# EAGLE design Qwiic_BME688 (EAGLE 9.5.2)
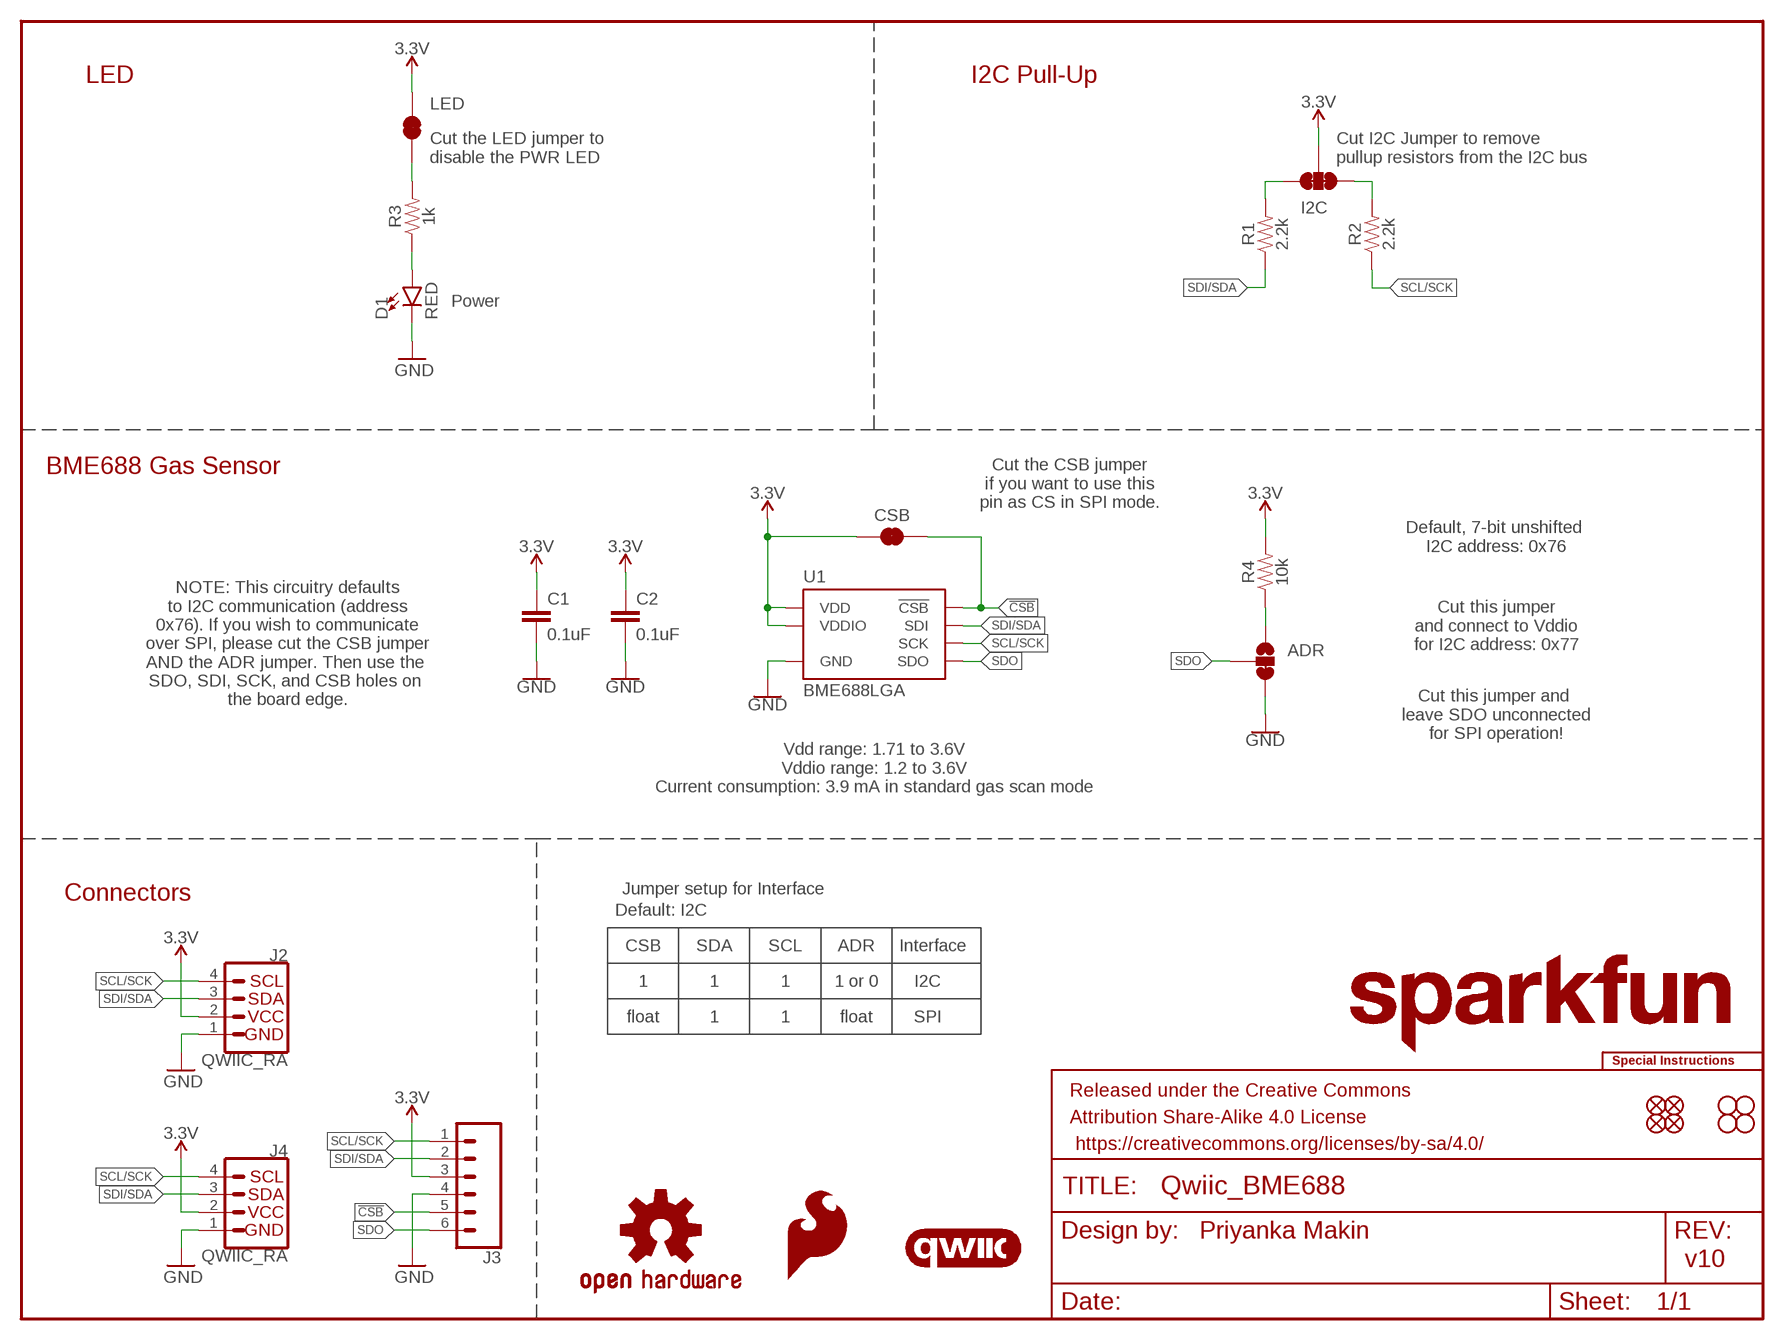
[diagram p0: schematic, sheet 1]

## Parts
ADR  JUMPER-SMT_3_1-NC_TRACE_SILK  [SMT-JUMPER_3_1-NC_TRACE_SILK]
C1  0.1uF  0.1UF-0603-100V-10%  [0603]
C2  0.1uF  0.1UF-0603-100V-10%  [0603]
CSB  JUMPER-SMT_2_NC_TRACE_SILK  [SMT-JUMPER_2_NC_TRACE_SILK]
D1  RED  LED-RED0603  [LED-0603]
FRAME1  FRAME-LETTER  [CREATIVE_COMMONS]
I2C  JUMPER-SMT_3_2-NC_TRACE_SILK  [SMT-JUMPER_3_2-NC_TRACE_SILK]
J2  QWIIC_RA  QWIIC_CONNECTORJS-1MM  [JST04_1MM_RA]
J3  CONN_06NO_SILK_NO_POP  [1X06_NO_SILK]
J4  QWIIC_RA  QWIIC_CONNECTORJS-1MM  [JST04_1MM_RA]
JP1  FIDUCIALUFIDUCIAL  [FIDUCIAL-MICRO]
JP2  FIDUCIALUFIDUCIAL  [FIDUCIAL-MICRO]
JP3  STAND-OFF  [STAND-OFF]
JP4  STAND-OFF  [STAND-OFF]
JP5  FIDUCIALUFIDUCIAL  [FIDUCIAL-MICRO]
JP6  FIDUCIALUFIDUCIAL  [FIDUCIAL-MICRO]
JP7  STAND-OFF  [STAND-OFF]
JP8  STAND-OFF  [STAND-OFF]
LED  JUMPER-SMT_2_NC_TRACE_SILK  [SMT-JUMPER_2_NC_TRACE_SILK]
LOGO1  SPECIAL_INSTRUCTIONS-ORDERING  [ORDERING_INSTRUCTIONS]
LOGO2  QWIIC_LOGO_5MM  [QWIIC_5MM]
LOGO3  SFE_LOGO_NAME.1_INCH  [SFE_LOGO_NAME_.1]
LOGO4  SFE_LOGO_FLAME.1_INCH  [SFE_LOGO_FLAME_.1]
LOGO5  OSHW-LOGOS  [OSHW-LOGO-S]
LOGO6  SFE_LOGO_NAME.1_INCH  [SFE_LOGO_NAME_.1]
R1  2.2k  2.2KOHM-0603-1/10W-1%  [0603]
R2  2.2k  2.2KOHM-0603-1/10W-1%  [0603]
R3  1k  1KOHM-0603-1/10W-1%  [0603]
R4  10k  10KOHM-0603-1/10W-1%  [0603]
U1  BME688LGA  [LGA_8PIN]

## Nets
3.3V: C1.1 C2.1 CSB.1 I2C.2 J2.2 J3.3 J4.2 LED.2 R4.2 U1.6(VDDIO) U1.8(VDD)
!CSB!: CSB.2 J3.5 U1.2(!CSB!)
GND: ADR.3 C1.2 C2.2 D1.C J2.1 J3.4 J4.1 U1.1(GND) U1.7(GND)
N$1: LED.1 R3.2
N$2: I2C.3 R1.2
N$3: D1.A R3.1
N$4: I2C.1 R2.2
N$5: ADR.1 R4.1
SCL/SCK: J2.4 J3.1 J4.4 R2.1 U1.4(SCK)
SDI/SDA: J2.3 J3.2 J4.3 R1.1 U1.3(SDI)
SDO: ADR.2 J3.6 U1.5(SDO)

## Notes on the sheet
- LED | I2C Pull-Up
- Cut the LED jumper to
  disable the PWR LED
- Cut I2C Jumper to remove 
  pullup resistors from the I2C bus
- Power
- BME688 Gas Sensor
- Cut the CSB jumper
  if you want to use this
  pin as CS in SPI mode.
- Default, 7-bit unshifted 
  I2C address: 0x76
- Cut this jumper
  and connect to Vddio
  for I2C address: 0x77
- NOTE: This circuitry defaults
  to I2C communication (address
  0x76). If you wish to communicate
  over SPI, please cut the CSB jumper
  AND the ADR jumper. Then use the 
  SDO, SDI, SCK, and CSB holes on 
  the board edge.
- Cut this jumper and 
  leave SDO unconnected
  for SPI operation!
- Vdd range: 1.71 to 3.6V
  Vddio range: 1.2 to 3.6V
  Current consumption: 3.9 mA in standard gas scan mode
- Connectors | Jumper setup for Interface
- Default: I2C
- CSB | SDA | SCL | ADR | Interface
- 1 | 1 | 1 | 1 or 0 | I2C
- float | 1 | 1 | float | SPI
- Priyanka Makin
- v10

## Library data of the parts
ADR = SparkFun-Jumpers:JUMPER-SMT_3_1-NC_TRACE: Normally closed trace jumper (1 of 2 connections) This jumper has a trace between two pads so it's normally closed (NC). The other connection is normally open (NO). Use a razor knife to open the connection. For best results follow the IPC guidelines for cutting traces: Cutout at least 0.063 mm (0.005 in). Remove all loose material to clean up the cut area. Seal the cut with an approved epoxy. Reapply solder to reclose the connection, or to close the NO connection.
C1 C2 = SparkFun-Capacitors:0.1UF: 0.1µF ceramic capacitors A capacitor is a passive two-terminal electrical component used to store electrical energy temporarily in an electric field.; PROD_ID: CAP-08390
CSB LED = SparkFun-Jumpers:JUMPER-SMT_2_NC_TRACE: Normally closed trace jumper This jumper has a trace between two pads so it's normally closed (NC). Use a razor knife to open the connection. For best results follow the IPC guidelines for cutting traces: Cutout at least 0.063 mm (0.005 in). Remove all loose material to clean up the cut area. Seal the cut with an approved epoxy. Reapply solder to reclose the connection.
D1 = SparkFun-LED:LED-RED: Red SMD LED Used in manufacturing of most products at SparkFun Packages: 0603 - SMD 0603 package [Product Link] <http://docs.avagotech.com/docs/AV02-0551EN> 0603 SMART - SMD 0603 SMART package ( more efficient and expensive)[Product Link] <http://www.osram-os.com/Graphics/XPic2/00077099_0.pdf> 1206 - SMD1206 package [Product Link] <https://www.sparkfun.com/datasheets/DevTools/LilyPad/Q150OVS4.pdff> SparkFun Products: Pro Mini 328 -5V <https://www.sparkfun.com/products/821> RedBoard <https://www.sparkfun.com/products/12757> IOIO-OTG <https://www.sparkfun.com/products/13613>; PROD_ID: DIO-00819
FRAME1 = SparkFun-Aesthetics:FRAME-LETTER: Schematic Frame - Letter Standard 8.5x11 US Letter frame
I2C = SparkFun-Jumpers:JUMPER-SMT_3_2-NC_TRACE: Normally closed trace jumper (2 of 2 connections) This jumper has a trace between all three pads so they are normally closed (NC). Use a razor knife to open the connection(s). For best results follow the IPC guidelines for cutting traces: Cutout at least 0.063 mm (0.005 in). Remove all loose material to clean up the cut area. Seal the cut with an approved epoxy. Reapply solder to reclose the connection(s).
J2 J4 = SparkFun-Connectors:QWIIC_CONNECTOR: SparkFun I2C Standard Qwiic Connector An SMD 1mm pitch JST connector makes it easy and quick (get it? Qwiic?) to connect I2C devices to each other. The Qwiic system <http://www.sparkfun.com/qwiic> enables fast and solderless connection between popular platforms and various sensors and actuators. We carry 200mm <https://www.sparkfun.com/products/14204>, 100mm <https://www.sparkfun.com/products/14205>, 50mm <https://www.sparkfun.com/products/14206>, and breadboard friendly <https://www.sparkfun.com/products/14207> Qwiic cables. We also offer 10 pcs strips <https://www.sparkfun.com/products/14323> the SMD connectors.; PROD_ID: CONN-13694; VALUE: QWIIC_RIGHT_ANGLE
J3 = SparkFun-Connectors:CONN_06: Multi connection point. Often used as Generic Header-pin footprint for 0.1 inch spaced/style header connections On any of the 0.1 inch spaced packages, you can populate with these: Break Away Headers - Straight <https://www.sparkfun.com/products/116> (PRT-00116) Break Away Male Headers - Right Angle <https://www.sparkfun.com/products/553> (PRT-00553) Female Headers <https://www.sparkfun.com/products/115> (PRT-00115) Break Away Headers - Machine Pin <https://www.sparkfun.com/products/117> (PRT-00117) Break Away Female Headers - Swiss Machine Pin <https://www.sparkfun.com/products/743> (PRT-00743) Arduino Stackable Header - 6 Pin <https://www.sparkfun.com/products/9280> (PRT-09280) For SCREWTERMINALS and SPRING TERMINALS visit here: Screw Terimnals on SparkFun.com <https://www.sparkfun.com/search/results?term=Screw+Terminals> (5mm/3.5mm/2.54mm spacing) This device is also useful as a general connection point to wire up your design to another part of your project. Our various solder wires solder well into these plated through hole pads. Hook-Up Wire - Assortment (Stranded, 22 AWG) <https://www.sparkfun.com/products/11375> (PRT-11375) Hook-Up Wire - Assortment (Solid Core, 22 AWG) <https://www.sparkfun.com/products/11367> (PRT-11367) View the entire wire category on our website here <https://www.sparkfun.com/categories/141>
JP1 JP2 JP5 JP6 = SparkFun-Aesthetics:FIDUCIAL: Fiducial Alignment Points Point-of-reference for pick-and-place machines and other optical instruments.
JP3 JP4 JP7 JP8 = SparkFun-Hardware:STAND-OFF: Stand Off Drill holes for mechanically mounting via screws, standoffs, etc. Note: Use the keepout ring to avoid running the screw head into surrounding components. Variant Overviews STAND-OFF - Mechanical footprint for a #4 phillips button head screw. STAND-OFF-TIGHT - Mechanical footprint for a #4 phillips button head screw, Example SparkFun Products Screw - Phillips Head (1/4", 4-40, 10 pack) <https://www.sparkfun.com/products/10453> (PRT-10453) Screw - Phillips Head (1/2", 4-40, 10 pack) <https://www.sparkfun.com/products/10452> (PRT-10452) Screw - Phillips Head (3/4", 4-40, 10 pack) <https://www.sparkfun.com/products/10451> (PRT-10451) Screw - Phillips Head (1", 4-40, 10 pack) <https://www.sparkfun.com/products/10450> (PRT-10450)
LOGO1 = SparkFun-Aesthetics:SPECIAL_INSTRUCTIONS: Special Ordering/Production Instructions Alert Symbol for special PCB ordering instructions or unique production process warnings. Ordering Instructions Production Instructions Types of information that should be added to box: Copper weight Soldermask color Silk color PCB thickness Number of layers PCB Standard: 1.6mm FR4 1 oz copper immersion silver plating red soldermask white silkscreen Types of information that should be added to box: Special wash requirements Depaneling instructions Humidification Glue curing Default text settings: 0.07 inch 9% ratio 50% line distance
LOGO2 = SparkFun-Aesthetics:QWIIC_LOGO: Qwiic Logos for placement on schematic and PCB. The 5.5mm silk logo is best for placing next to Qwiic connector.
LOGO3 LOGO6 = SparkFun-Aesthetics:SFE_LOGO_NAME: SparkFun Font Logo This is the SparkFun name logo. The logo on the schematic will always be the same size; the package variant is the height of the flame part of the logo (or the height the flame would be, if it were drawn). Default layer for the logo on the board is tSilk.
LOGO4 = SparkFun-Aesthetics:SFE_LOGO_FLAME: SparkFun Flame Logo This is the SparkFun flame logo. The logo on the schematic will always be the same size; the package variant is the height of the flame. Default layer for the logo on the board is tSilk.
LOGO5 = SparkFun-Aesthetics:OSHW-LOGO: Open-Source Hardware (OSHW) Logo This logo indicates the piece of hardware it is found on incorporates a OSHW license and/or adheres to the definition of open source hardware found here: http://freedomdefined.org/OSHW
R1 R2 = SparkFun-Resistors:2.2KOHM: 2.2kΩ resistor A resistor is a passive two-terminal electrical component that implements electrical resistance as a circuit element. Resistors act to reduce current flow, and, at the same time, act to lower voltage levels within circuits. - Wikipedia; PROD_ID: RES-08272
R3 = SparkFun-Resistors:1KOHM: 1kΩ resistor A resistor is a passive two-terminal electrical component that implements electrical resistance as a circuit element. Resistors act to reduce current flow, and, at the same time, act to lower voltage levels within circuits. - Wikipedia; PROD_ID: RES-07856
R4 = SparkFun-Resistors:10KOHM: 10kΩ resistor A resistor is a passive two-terminal electrical component that implements electrical resistance as a circuit element. Resistors act to reduce current flow, and, at the same time, act to lower voltage levels within circuits. - Wikipedia; PROD_ID: RES-00824
U1 = BME688:BME688: BME688 gas sensor from Bosch.

## Net classes
1 power: width 0.203 mm

## Board
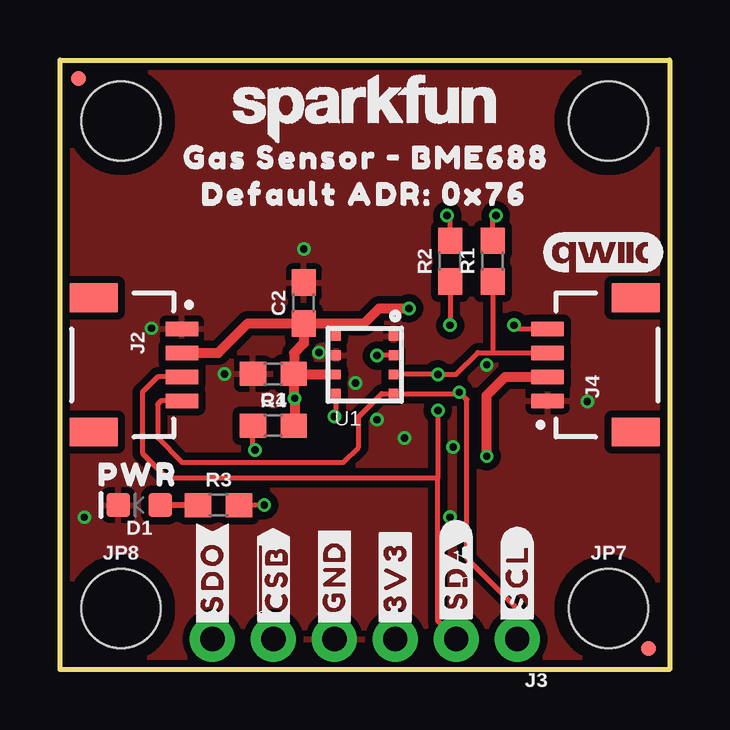
[diagram p1: board, top side]
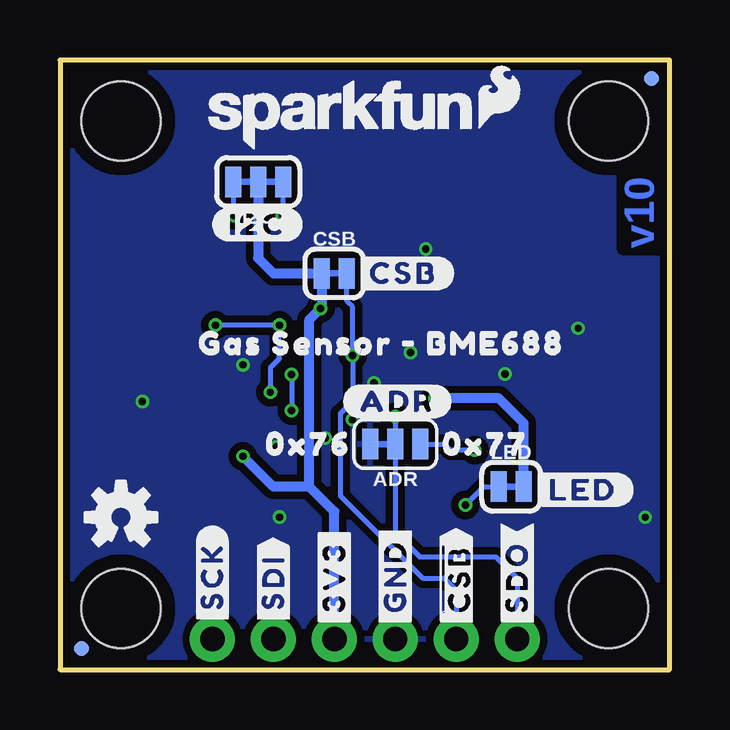
[diagram p2: board, bottom side, seen from below]

Size 25.4 x 25.4 mm. Coordinates in mm from the lower left corner, seen from the top.
Outline: 0,0 0,25.4 25.4,25.4 25.4,0 0,0
Copper layers (1*16): Top 0.035mm / dielectric 1.5mm / Bottom 0.035mm
Design rules "SparkFun-2-Layer-Minimum-JLCPCB": minimum track width 5mil, minimum drill 0.3mm, track to track 5mil, track to pad 5mil, pad to pad 5mil, via to via 5mil, smd to smd 5mil, copper to edge 7mil, drill to drill 7mil, minimum pad ring 5mil, minimum via ring 5mil, stop-mask expansion 2.5mil, vias tented up to drill 25mil, thermal gap 10mil

### Footprints (pad centres in the part's own frame; a part is rotated, then mirrored left to right if it is on the bottom)
SMT-JUMPER_3_1-NC_TRACE_SILK = smd 0.66 x 1.27: 1 -1.041,0; 2 0,0; 3 1.041,0
0603 = smd 1.1 x 1: 1 -0.85,0; 2 0.85,0
SMT-JUMPER_2_NC_TRACE_SILK = smd 0.66 x 1.27: 1 -0.521,0; 2 0.521,0
LED-0603 = smd 1 x 1: A -0.877,0; C 0.877,0
SMT-JUMPER_3_2-NC_TRACE_SILK = smd 0.66 x 1.27: 1 -1.041,0; 2 0,0; 3 1.041,0
JST04_1MM_RA = smd 0.6 x 1.35: 1 -1.5,0; 2 -0.5,0; 3 0.5,0; 4 1.5,0 | smd 1.2 x 2: NC1 2.8,-3.675; NC2 -2.8,-3.675
1X06_NO_SILK = drill 1.016 pad 1.88: 1 0,0; 2 2.54,0; 3 5.08,0; 4 7.62,0; 5 10.16,0; 6 12.7,0
FIDUCIAL-MICRO = smd 0.635 x 0.635: 1 0,0
STAND-OFF = hole 3.302: 0,0
LGA_8PIN = smd 0.4 x 0.4: 1 1.2,1.2; 2 1.2,0.4; 3 1.2,-0.4; 4 1.2,-1.2; 5 -1.2,-1.2; 6 -1.2,-0.4; 7 -1.2,0.4; 8 -1.2,1.2

### Placement (x,y rotation side)
ADR  11.43,9.4 180 bottom
C1  8.89,12.32 180 top
C2  10.16,15.28 90 top
CSB  13.97,16.51 0 bottom
D1  3.3,6.86 180 top
FRAME1  45.72,-10.16 0 top  (outside the outline)
I2C  17.14,20.32 180 bottom
J2  5.08,12.7 270 top
J3  19.05,1.27 180 top
J4  20.32,12.7 90 top
JP1  0.76,24.64 0 bottom
JP2  24.51,0.89 0 top
JP3  2.54,22.86 0 top
JP4  22.86,22.86 0 top
JP5  24.51,0.89 0 bottom
JP6  0.76,24.64 0 top
JP7  22.86,2.54 0 top
JP8  2.54,2.54 0 top
LED  6.6,7.62 0 bottom
LOGO1  30.48,50.8 0 top  (outside the outline)
LOGO2  22.61,17.4 0 top
LOGO3  13.72,23.11 0 bottom
LOGO4  7.11,23.88 0 bottom
LOGO5  22.86,6.35 0 bottom
LOGO6  12.7,23.37 0 top
R1  18.03,17.02 90 top
R2  16.26,17.02 90 top
R3  6.6,6.86 0 top
R4  8.89,10.16 0 top
U1  12.7,12.7 0 top
U$1  [#GND#0]  11.43,1.65 90 bottom
U$2  [#SDO#0]  6.35,1.65 90 top
U$3  [#CSB#0]  13.21,16.51 0 bottom
U$5  [PWR0]  0.89,8.13 0 top
U$6  [#I2C#0]  19.05,18.54 0 bottom
U$7  [GAS_SENSOR_#_BME6880]  20.32,13.59 0 bottom
U$8  [#LED#0]  5.71,7.49 0 bottom
U$9  [0X760]  17.53,9.4 0 bottom
U$10  [GAS_SENSOR_#_BME6880]  4.45,21.34 0 top
U$11  [#ADR#0]  13.59,11.18 0 bottom
U$12  [DEFAULT_ADR#_0X760]  5.21,19.81 0 top
U$13  [0X770]  10.16,9.4 0 bottom
U$14  [#3V3#0]  13.97,1.65 90 top
U$15  [#3V3#0]  13.97,1.65 90 bottom
U$16  [#SDO#0]  6.35,1.65 90 bottom
U$19  [#SDI#0]  16.51,1.78 90 bottom
U$20  [#SCK#0]  19.05,1.78 90 bottom
U$21  [##CSB##0]  8.89,1.65 90 bottom
U$22  [##CSB##0]  8.89,1.65 90 top
U$33  [#GND#0]  11.43,1.65 90 top
U$35  [#SDA#0]  16.51,1.78 90 top
U$36  [#SCL#0]  19.05,1.78 90 top

### Tracks (layer width: path | path; a pad name or v marks a point on that pad's centre or on a via)
3.3V  (via drill 0.3)
  Top 0.406: J4.2 18.54,12.19 17.78,11.43 v17.78,8.89 | 9.76,12.3 C1.1 9.74,11.34 v9.78,11.3 9.78,10.2 R4.2 | 9.76,12.3 U1.6 | J2.2 6.6,13.2 7.83,14.43 C2.1 | C2.1 10.16,13.59 9.76,13.19 9.76,12.3 | C2.1 11.43,14.43 | 11.43,14.43 12.67,14.43 13.29,15.05 v14.54,15.05 | U1.8 11.5,14.36 11.43,14.43
  Bottom 0.406: v17.78,8.89 16.51,7.62 15.01,7.62 | I2C.2 17.14,17.14 16.51,16.51 CSB.1 14.48,16.51 14.48,15.11 v14.54,15.05 15.01,14.58 15.01,7.62 | J3.3 13.97,6.58 15.01,7.62 | LED.2 6.08,10.27 7.11,11.3 v9.78,11.3
!CSB!  (via drill 0.3)
  Top 0.203: U1.2 13.23,13.1 v13.21,13.08
  Bottom 0.203: CSB.2 13.45,15.35 13.21,15.11 v13.21,13.08 13.21,11.18 13.72,10.67 13.72,7.24 10.29,3.81 9.4,3.81 8.89,3.3 J3.5
GND  (via drill 0.3)
  other vias: 1.02,6.35 3.81,14.22 6.86,12.32 10.16,17.53 10.79,13.21 13.21,10.41 21.97,11.18 12.32,11.94 14.35,9.65 16.26,6.35 17.78,12.7 16.38,9.27
  pour Bottom (isolate 0.305): 0,0 0,25.4 25.4,25.4 25.4,0
  pour Top (isolate 0.305): 0,0 0,25.4 25.4,25.4 25.4,0
N$1  (via drill 0.3)
  Top 0.203: v8.51,6.86 R3.2
  Bottom 0.203: v8.51,6.86 7.75,7.62 LED.1
N$2  (via drill 0.3)
  Top 0.203: R1.2 18.03,18.8 v18.16,18.92
  Bottom 0.203: v18.16,18.92 18.16,20.3 I2C.3
N$3
  Top 0.254: R3.1 D1.A
N$4  (via drill 0.3)
  Top 0.203: R2.2 16.26,18.8 v16.13,18.92
  Bottom 0.203: v16.13,18.92 16.1,18.95 I2C.1
N$5  (via drill 0.3)
  Top 0.203: v8.13,9.14 8.04,9.23 R4.1
  Bottom 0.203: v8.13,9.14 9.14,9.14 9.4,9.4 ADR.1
SCL/SCK  (via drill 0.3)
  Top 0.203: 16.69,11.5 U1.4 13.4,11.5 12.45,10.54 12.45,9.27 11.81,8.64 5.08,8.64 4.06,9.65 4.06,11.05 4.21,11.2 J2.4 | 16.69,11.5 16.95,11.25 16.95,4.64 19.05,2.54 J3.1 | 16.69,11.5 v16.64,11.56 | v18.92,14.35 19.07,14.2 J4.4 | R2.1 v16.26,14.35
  Bottom 0.203: v16.64,11.56 16.64,12.57 16.26,12.95 v16.26,14.35 v18.92,14.35
SDI/SDA  (via drill 0.3)
  Top 0.203: U1.3 v15.75,12.3 16.49,12.3 17.4,13.21 18.03,13.21 | 18.03,13.21 J4.3 | R1.1 18.03,13.21 | v15.75,10.79 15.75,8 | J2.3 4.07,12.2 3.43,11.56 3.43,9.02 4.45,8 15.75,8 | J3.2 15.75,2.03 15.75,8
  Bottom 0.203: v15.75,12.3 v15.75,10.79
SDO  (via drill 0.3)
  Top 0.203: v11.43,10.54 11.5,10.61 U1.5
  Bottom 0.203: v11.43,10.54 ADR.2 11.43,5.71 10.41,4.7 7.24,4.7 6.35,3.81 J3.6

### Text on the board
Bottom: v10
Measures: Dimensions in inches
tDocu: 2 Layers / 1.6mm Thickness / HASL lead-free Finish | Priyanka Makin